# EAGLE design bristol_longshot (EAGLE 7.3.0)
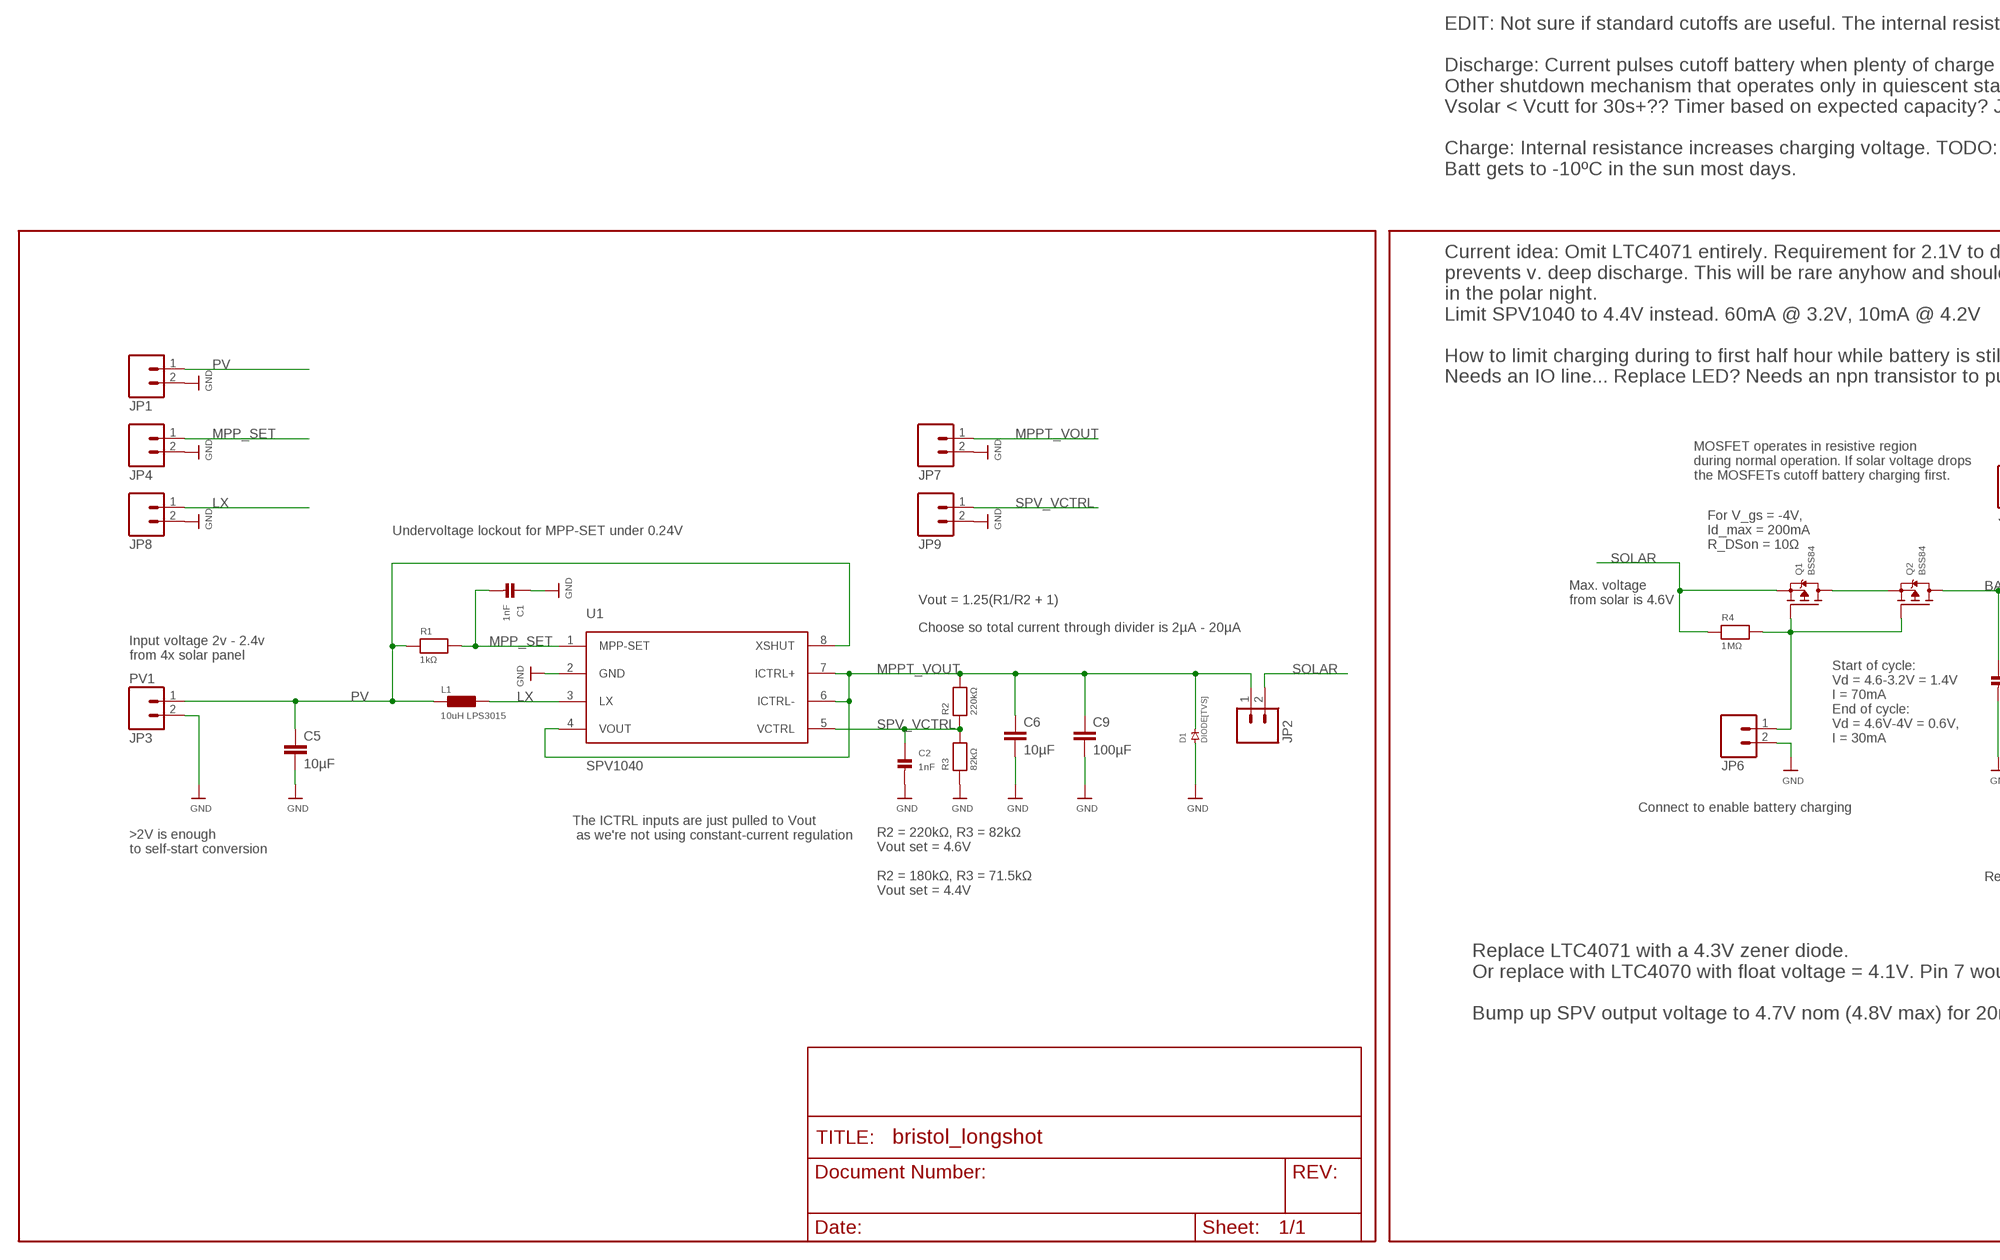
[diagram p0: schematic, sheet 1, part 1 of 2]
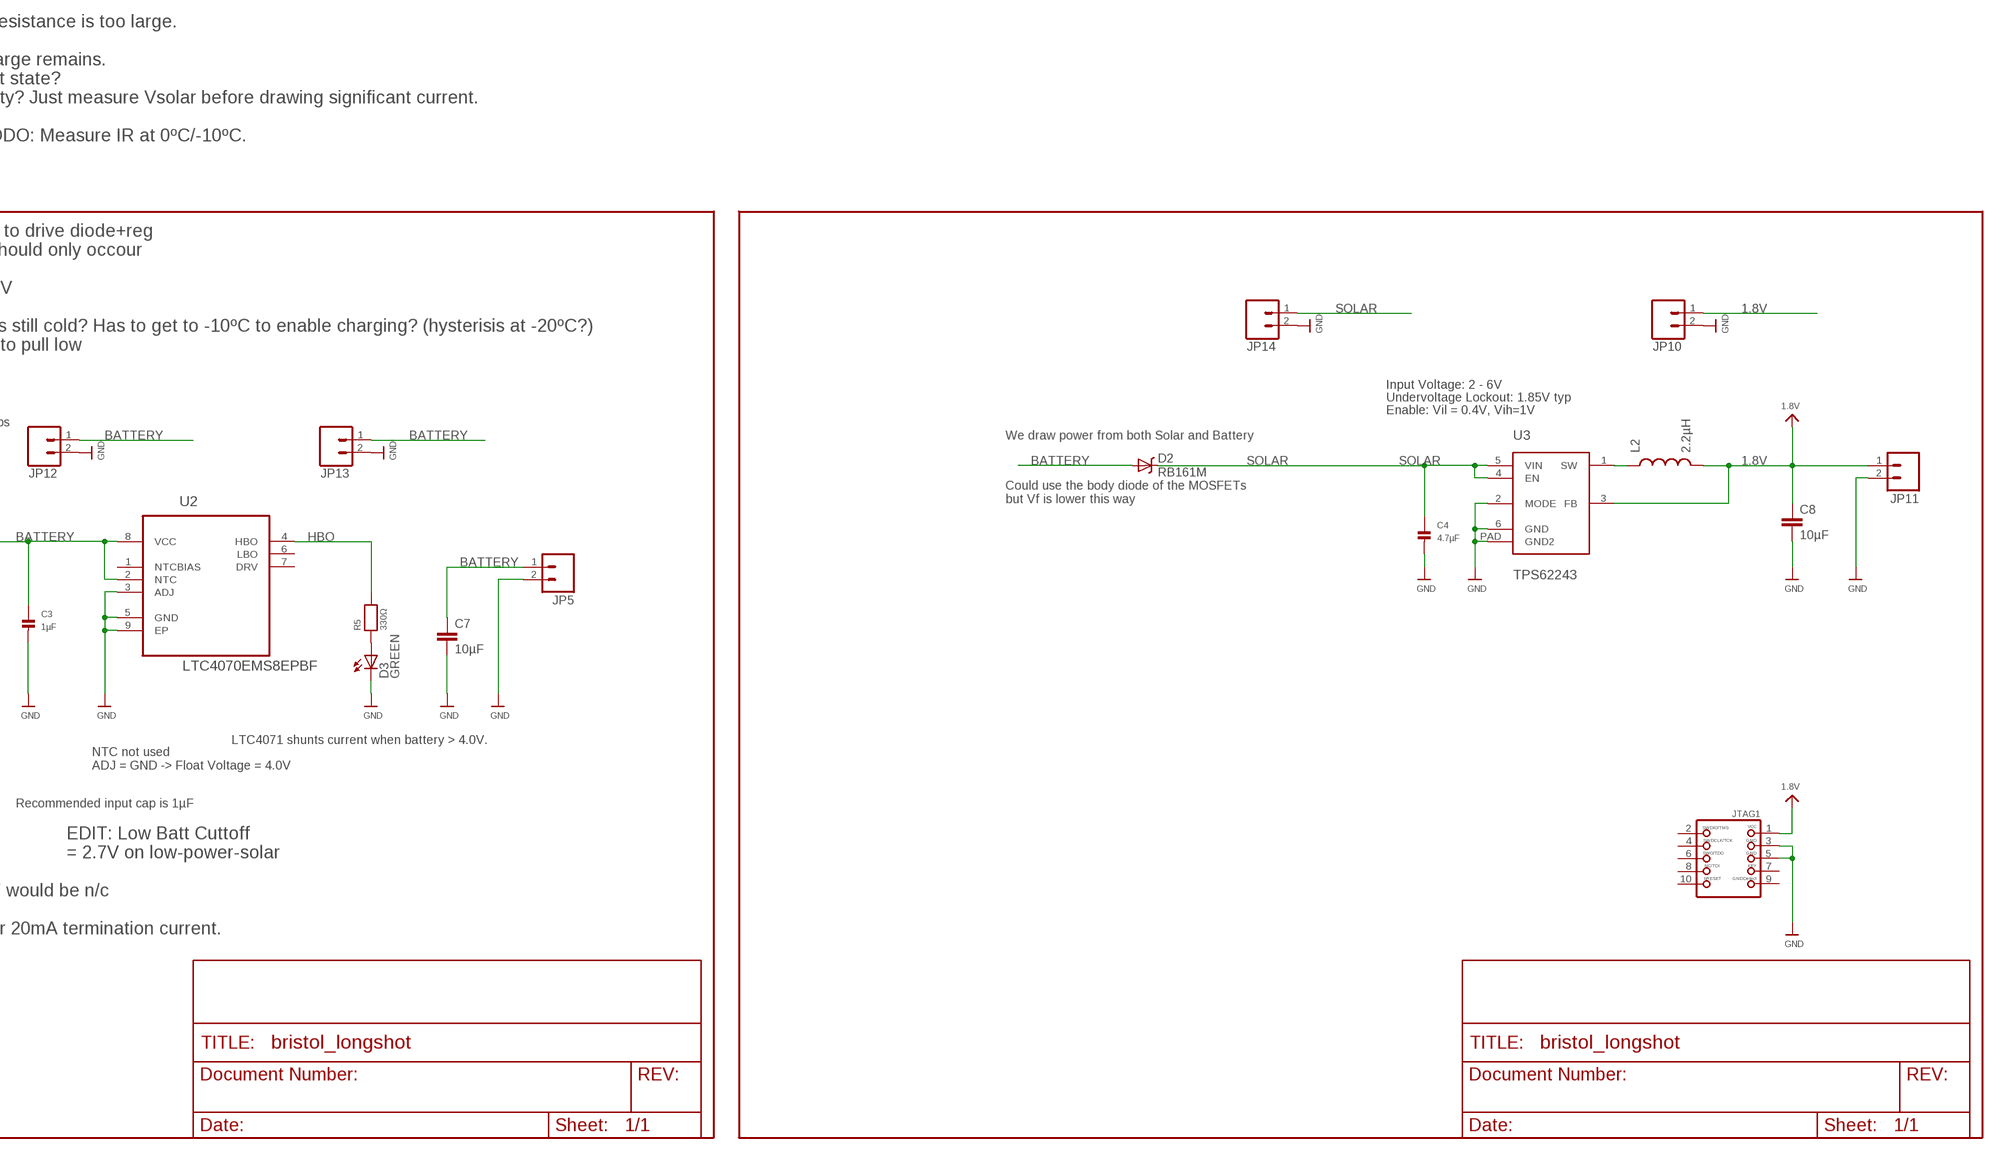
[diagram p1: schematic, sheet 1, part 2 of 2]

## Parts
C1  1nF  CAP_CERAMIC_0402  [_0402@1]
C2  1nF  CAP_CERAMIC_0402  [_0402@1]
C3  1µF  CAP_CERAMIC_0402  [_0402@1]
C4  4.7µF  CAP_CERAMIC_0402  [_0402@1]
C5  10µF  C-EUC0603K  [C0603K]
C6  10µF  C-EUC0603K  [C0603K]
C7  10µF  C-EUC0603K  [C0603K]
C8  10µF  C-EUC0603K  [C0603K]
C9  100µF  C-EUC1206K  [C1206K]
D1  DIODE[TVS]  [SOD123W]
D2  RB161M  [RB161M]
D3  GREEN  LEDCHIPLED_0603  [CHIPLED_0603]
JP1  M02LOCK  [1X02_LOCK]
JP2  M02LOCK  [1X02_LOCK]
JP3  PV1  M023.5MM_LOCK  [SCREWTERMINAL-3.5MM-2_LOCK]
JP4  M02LOCK  [1X02_LOCK]
JP5  M023.5MM_LOCK  [SCREWTERMINAL-3.5MM-2_LOCK]
JP6  M02LOCK  [1X02_LOCK]
JP7  M02LOCK  [1X02_LOCK]
JP8  M02LOCK  [1X02_LOCK]
JP9  M02LOCK  [1X02_LOCK]
JP10  M02LOCK  [1X02_LOCK]
JP11  M023.5MM_LOCK  [SCREWTERMINAL-3.5MM-2_LOCK]
JP12  M02LOCK  [1X02_LOCK]
JP13  M02LOCK  [1X02_LOCK]
JP14  M02LOCK  [1X02_LOCK]
JTAG1  JTAG-CORTEXM3SMT  [2X05_1.27MM_SMT]
L1  10uH LPS3015  IND-LPS3015  [LPS3015]
L2  2.2µH  INDUCTOR1007  [1007]
Q1  BSS84  NX2301P  [SOT23]
Q2  BSS84  NX2301P  [SOT23]
R1  1kΩ  RESISTOR_0402  [_0402]
R2  220kΩ  RESISTOR_0402  [_0402]
R3  82kΩ  RESISTOR_0402  [_0402]
R4  1MΩ  RESISTOR_0402  [_0402]
R5  330Ω  RESISTOR_0402  [_0402]
U1  SPV1040  [TSSOP8]
U2  LTC4070EMS8EPBF  [SOP65P490X110-9N]
U3  TPS62243  [S-PWSON-N6]

## Nets
1.8V: C8.1 JP10.1 JP11.1 JTAG1.1 L2.2 U3.3(FB)
BATT_MOSFET_CTRL: JP6.1 Q1.1(G) Q2.1(G) R4.2
BATTERY: C3.1 C7.1 D2.ANODE(A) JP5.1 JP12.1 JP13.1 Q2.3(D) U2.2(NTC) U2.8(VCC)
BATTERY_MOSFET_1: Q1.3(D) Q2.2(S)
CHG_LED: D3.A R5.1
GND: C1.1 C2.2 C3.2 C4.2 C5.2 C6.2 C7.2 C8.2 C9.2 D1.P$1 D3.C JP1.2 JP3.2 JP4.2 JP5.2 JP6.2 JP7.2 JP8.2 JP9.2 JP10.2 JP11.2 JP12.2 JP13.2 JP14.2 JTAG1.3 JTAG1.5 R3.1 U1.2(GND) U2.3(ADJ) U2.5(GND) U2.9(EP) U3.2(MODE) U3.6(GND) U3.PAD(GND2)
HBO: R5.2 U2.4(HBO)
LX: JP8.1 L1.2_1 L1.2_2 L1.2_3 L1.2_4 L1.2_5 L1.2_6 L1.2_7 L1.2_8 L1.2_9 U1.3(LX)
MPP_SET: C1.2 JP4.1 R1.2 U1.1(MPP-SET)
MPPT_VOUT: C6.1 C9.1 D1.P$2 JP2.1 JP7.1 R2.2 U1.4(VOUT) U1.6(ICTRL-) U1.7(ICTRL+)
N$7: L2.1 U3.1(SW)
PV: C5.1 JP1.1 JP3.1 L1.1_1 L1.1_2 L1.1_3 L1.1_4 L1.1_5 L1.1_6 L1.1_7 L1.1_8 L1.1_9 R1.1 U1.8(XSHUT)
SOLAR: C4.1 D2.CATHODE(C) JP2.2 JP14.1 Q1.2(S) R4.1 U3.4(EN) U3.5(VIN)
SPV_VCTRL: C2.1 JP9.1 R2.1 R3.2 U1.5(VCTRL)
Unconnected: JTAG1.2 JTAG1.4 JTAG1.6 JTAG1.7 JTAG1.8 JTAG1.9 JTAG1.10 U2.6(LBO) U2.7(DRV)

## Notes on the sheet
- EDIT: Not sure if standard cutoffs are useful. The internal resistance is too large.
  
  Discharge: Current pulses cutoff battery when plenty of charge remains.
  Other shutdown mechanism that operates only in quiescent state? 
  Vsolar < Vcutt for 30s+?? Timer based on expected capacity? Just measure Vsolar before drawing significant current.
  
  Charge: Internal resistance increases charging voltage. TODO: Measure IR at 0ºC/-10ºC.
  Batt gets to -10ºC in the sun most days.
- Current idea: Omit LTC4071 entirely. Requirement for 2.1V to drive diode+reg
  prevents v. deep discharge. This will be rare anyhow and should only occour 
  in the polar night.
  Limit SPV1040 to 4.4V instead. 60mA @ 3.2V, 10mA @ 4.2V
  
  How to limit charging during to first half hour while battery is still cold? Has to get to -10ºC to enable charging? (hysterisis at -20ºC?)
  Needs an IO line... Replace LED? Needs an npn transistor to pull low
- Input Voltage: 2 - 6V
- Undervoltage Lockout: 1.85V typ
- Enable: Vil = 0.4V, Vih=1V
- MOSFET operates in resistive region
  during normal operation. If solar voltage drops
  the MOSFETs cutoff battery charging first.
- We draw power from both Solar and Battery
- Undervoltage lockout for MPP-SET under 0.24V
- For V_gs = -4V,
  Id_max = 200mA
  R_DSon = 10Ω
- Could use the body diode of the MOSFETs
  but Vf is lower this way
- Vout = 1.25(R1/R2 + 1)
- Max. voltage
  from solar is 4.6V
- Choose so total current through divider is 2µA - 20µA
- Input voltage 2v - 2.4v
  from 4x solar panel
- Start of cycle:
  Vd = 4.6-3.2V = 1.4V
  I = 70mA
  End of cycle: 
  Vd = 4.6V-4V = 0.6V, 
  I = 30mA
- Connect to enable battery charging | LTC4071 shunts current when battery > 4.0V.
- The ICTRL inputs are just pulled to Vout
   as we're not using constant-current regulation
- NTC not used
  ADJ = GND -> Float Voltage = 4.0V
- >2V is enough
  to self-start conversion
- Recommended input cap is 1µF
- R2 = 220kΩ, R3 = 82kΩ
  Vout set = 4.6V
  
  R2 = 180kΩ, R3 = 71.5kΩ
  Vout set = 4.4V
- EDIT: Low Batt Cuttoff
  = 2.7V on low-power-solar
- Replace LTC4071 with a 4.3V zener diode.
  Or replace with LTC4070 with float voltage = 4.1V. Pin 7 would be n/c
  
  Bump up SPV output voltage to 4.7V nom (4.8V max) for 20mA termination current.

## Power pins joined to a net without a drawn wire
NTCBIAS: U2.1(NTCBIAS)

## Library data of the parts
C1-C4 = microbuilder_v3:CAP_CERAMIC: Ceramic Capacitors 0402 - 0402 Surface Mount Capacitors 16pF 50V 5% [Digikey: 445-4899-2-ND] 18pF 50V 5% [Digikey: 490-1281-2-ND] 22pF 50V 5% [Digikey: 490-1283-2-ND] 68pF 50V 5% [Digikey: 490-1289-2-ND] 0.1uF 10V 10% [Digikey: 490-1318-2-ND] 1.0uF 6.3V 10% [Digikey: 490-1320-2-ND] 0603 - 0603 Surface Mount Capacitors 16 pF 50V 5% [Digikey: 445-5051-2-ND] 22 pF 50V [Digikey: PCC220ACVTR-ND] 33 pF 50V 5% [Digikey: 490-1415-1-ND] 56pF 50V 5% [Digikey: 490-1421-1-ND] 220pF 50V 5% [Digikey: 445-1285-1-ND] 680 pF 50V 2200 pF 50V 5% C0G [Digikey: 445-1297-1-ND] 5600 pF 100V 5% X7R [Digikey: 478-3711-1-ND] 0.1 µF 25V 10% [Digikey: PCC2277TR-ND] 0.22 µF 16V 10% X7R [Digikey: 445-1318-1-ND] 1.0 µF 25V 10% [Digikey: 445-5146-2-ND] 0603 - RF Specific 3pF 250V +/-0.1pF RF [Digikey: 712-1347-1-ND] 18 pF 250V 5% [Digikey: 478-3505-1-ND or 712-1322-1-ND] 56 pF 250V 5% C0G RF [Digikey: 490-4867-1-ND] 68 pF 250V RF [Digikey: 490-4868-1-ND] 0805 - 0805 Surface Mount Capacitors 220 pF 250V 2% RF Ceramic Capacitor [Digikey: 712-1398-1-ND] 1000 pF 50V 2% NP0 Ceramic Capacitor [Digikey: 478-3760-1-ND] 0.1 µF 25V 10% Ceramic Capacitor [Digikey: PCC1828TR-ND] 1.0 µF 16V 10% Ceramic Capacitor[Digikey: 490-1691-2-ND] 10.0 µF 10V 10% Ceramic Capacitor[Digikey: 709-1228-1-ND] 10.0 uF 16V 10% Ceramic Capacitor [Digikey: 478-5165-2-ND] 47 uF 6.3V 20% Ceramic Capacitor [Digikey: 587-1779-1-ND or 399-5506-1-ND] 1206 - 1206 Surface Mount Capacitors 47uF 10V 20% Ceramic Capacitor [Digikey: 490-5528-1-ND or 399-5508-1-ND or 445-6010-1-ND] 100uF 6.3V -20%, +80% Y5V Ceramic Capacitor (Digikey: 490-4512-1-ND, Mouser: 81-GRM31CF50J107ZE1L)
C5-C9 = resistor:C-EU: CAPACITOR, European symbol
D1 = nxp:DIODE[TVS]
D2 = RB161M:RB161M
D3 = led:LED: LED OSRAM: - CHIPLED LG R971, LG N971, LY N971, LG Q971, LY Q971, LO R971, LY R971 LH N974, LH R974 LS Q976, LO Q976, LY Q976 LO Q996 - Hyper CHIPLED LW Q18S LB Q993, LB Q99A, LB R99A - SideLED LS A670, LO A670, LY A670, LG A670, LP A670 LB A673, LV A673, LT A673, LW A673 LH A674 LY A675 LS A676, LA A676, LO A676, LY A676, LW A676 LS A679, LY A679, LG A679 - Hyper Micro SIDELED® LS Y876, LA Y876, LO Y876, LY Y876 LT Y87S - SmartLED LW L88C, LW L88S LB L89C, LB L89S, LG L890 LS L89K, LO L89K, LY L89K LS L896, LA L896, LO L896, LY L896 - TOPLED LS T670, LO T670, LY T670, LG T670, LP T670 LSG T670, LSP T670, LSY T670, LOP T670, LYG T670 LG T671, LOG T671, LSG T671 LB T673, LV T673, LT T673, LW T673 LH T674 LS T676, LA T676, LO T676, LY T676, LB T676, LH T676, LSB T676, LW T676 LB T67C, LV T67C, LT T67C, LS T67K, LO T67K, LY T67K, LW E67C LS E67B, LA E67B, LO E67B, LY E67B, LB E67C, LV E67C, LT E67C LW T67C LS T679, LY T679, LG T679 LS T770, LO T770, LY T770, LG T770, LP T770 LB T773, LV T773, LT T773, LW T773 LH T774 LS E675, LA E675, LY E675, LS T675 LS T776, LA T776, LO T776, LY T776, LB T776 LHGB T686 LT T68C, LB T68C - Hyper Mini TOPLED® LB M676 - Mini TOPLED Santana® LG M470 LS M47K, LO M47K, LY M47K Source: http://www.osram.convergy.de LUXEON: - LUMILED® LXK2-PW12-R00, LXK2-PW12-S00, LXK2-PW14-U00, LXK2-PW14-V00 LXK2-PM12-R00, LXK2-PM12-S00, LXK2-PM14-U00 LXK2-PE12-Q00, LXK2-PE12-R00, LXK2-PE12-S00, LXK2-PE14-T00, LXK2-PE14-U00 LXK2-PB12-K00, LXK2-PB12-L00, LXK2-PB12-M00, LXK2-PB14-N00, LXK2-PB14-P00, LXK2-PB14-Q00 LXK2-PR12-L00, LXK2-PR12-M00, LXK2-PR14-Q00, LXK2-PR14-R00 LXK2-PD12-Q00, LXK2-PD12-R00, LXK2-PD12-S00 LXK2-PH12-R00, LXK2-PH12-S00 LXK2-PL12-P00, LXK2-PL12-Q00, LXK2-PL12-R00 Source: www.luxeon.com KINGBRIGHT: KA-3528ASYC Source: www.kingbright.com
JP1-JP14 = SparkFun:M02: Header 2 Standard 2-pin 0.1" header. Use with straight break away headers (SKU : PRT-00116), right angle break away headers (PRT-00553), swiss pins (PRT-00743), machine pins (PRT-00117), and female headers (PRT-00115). Molex polarized connector foot print use with SKU : PRT-08233 with associated crimp pins and housings.
JTAG1 = microbuilder_v3:JTAG-CORTEXM3: Serial Wire (SW-DP) Connector This standard 0.05" 10-pin connector is for use with the Cortex M0/M3's native SWD (serial wire debugger) interface (SW-DP). Some boards support a 20-pin combined JTAG+SWD connector (SWJ-DP), such as the LPC1700 family, but many smaller devices only work with SWD which typically use the smaller 10-pin SW-DP connecter (the LPC1300 family, for example, only supports SWD). 2x05 1.27mm/0.05" Connector: This is the standard SMT connector defined by ARM for all Cortex devices, and should be used in most situations and for forward-compatibility since any new devices coming to market will likely use this connector. MOLEX 10 Pin 0.1" Connector: This 0.1" 10 pin connector has the same pin layout as the standard 0.05" connector, but is easier to work with if you are using standard jumper wires or custom cables to connect your SWD hardware. MOLEX 20 Pin 0.1" Connector: This 0.1" 20 pin connector is the same model used for ARM7/ARM9 JTAG debuggers, but is connected to match the pins on the Segger J-Link for ARM (which supports both JTAG and SWD debugging). See the following document from ARM for more information on Cortex M3 Debug Connectors: http://infocenter.arm.com/help/topic/com.arm.doc.faqs/attached/13634/cortex_debug_connectors.pdf And the following page for an overview with images of the different connector types: http://www.keil.com/peripherals/coresight/connectors.asp
L1 = PecanFemto4:IND-LPS3015
L2 = SparkFun:INDUCTOR: Inductors Basic Inductor/Choke - 0603 and 1206. Footprints are not proven and vary greatly between part numbers.
Q1 Q2 = nxp:NX2301P
R1-R5 = microbuilder_v3:RESISTOR: Resistors 0402 - 0402 Surface Mount Package 22 Ohm 1% 1/16W [Digikey: 311-22.0LRTR-ND] 33 Ohm 5% 1/16W 1.0K 5% 1/16W 1.5K 5% 1/16W 2.0K 1% 1/16W 10.0K 1% 1/16W [Digikey: 311-10.0KLRTR-ND] 10.0K 5% 1/16W [Digikey: RMCF0402JT10K0TR-ND] 12.1K 1% 1/16W [Digikey: 311-22.0LRTR-ND] 100.0K 5% 1/16W 0603 - 0603 Surface Mount Package 0 Ohm 1/10 Watt 1% Resistor 15 Ohm 1/10 Watt 1% Resistor 33 Ohm 1/10 Watt 1% Resistor 49.9 Ohm 1/10 Watt 1% Resistor 100 Ohm 1/10 Watt 1% Resistor 150 Ohm 1/10 Watt 1% Resistor 240 Ohm 1/10 Watt 1% Resistor 390 Ohm 1/10 Watt 1% Resistor 560 Ohm 1/10 Watt 1% Resistor 680 Ohm 1/10 Watt 1% Resistor 750 Ohm 1/10 Watt 1% Resistor 1.0K Ohm 1/10 Watt 1% Resistor 1.5K Ohm 1/10 Watt 1% Resistor 2.0K Ohm 1/10 Watt 1% Resistor 2.2K Ohm 1/10 Watt 1% Resistor 3.3K Ohm 1/10 Watt 1% Resistor 4.7K Ohm 1/10 Watt 1% Resistor 10.0K Ohm 1/10 Watt 1% Resistor 12.0K Ohm 1/10 Watt 1% Resistor 12.1K Ohm 1/10 Watt 1% Resistor 20.0K Ohm 1/10 Watt 1% Resistor 33.0K Ohm 1/10 Watt 1% Resistor 100.0K Ohm 1/10 Watt 1% Resistor 0805 - 0805 Surface Mount Package 0 Ohm 1/8 Watt 1% Resistor 33 Ohm 1/8 Watt 1% Resistor 100 Ohm 1/8 Watt 1% Resistor 150 Ohm 1/8 Watt 1% Resistor 200 Ohm 1/8 Watt 1% Resistor 240 Ohm 1/8 Watt 1% Resistor 330 Ohm 1/8 Watt 1% Resistor 390 Ohm 1/8 Watt 1% Resistor 470 Ohm 1/8 Watt 1% Resistor 1.0K Ohm 1/8 Watt 1% Resistor 1.5K Ohm 1/8 Watt 1% Resistor 2.0K Ohm 1/8 Watt 1% Resistor 4.7K Ohm 1/8 Watt 1% Resistor 5.1K Ohm 1/8 Watt 1% Resistor 5.6K Ohm 1/8 Watt 1% Resistor 10.0K Ohm 1/8 Watt 1% Resistor 22.0K Ohm 1/8 Watt 1% Resistor 33.0K Ohm 1/8 Watt 1% Resistor 100K Ohm 1/8 Watt 1% Resistor 1206 - 1206 Surface Mount Package 2012 - 2010 Surface Mount Package 0.11 Ohm 1/2 Watt 1% Resistor - Digikey: RHM.11UCT-ND
U1 = spv1040:SPV1040
U2 = LTC4070_EMS8:LTC4070EMS8EPBF: Li-Ion/Polymer Shunt Battery Charger System; MPN: LTC4070EMS8E#PBF; OC_FARNELL: 1839141; OC_NEWARK: 67R4287; PACKAGE: MSOP-8; SUPPLIER: Linear Technology
U3 = TPS62243:TPS62243

## Board
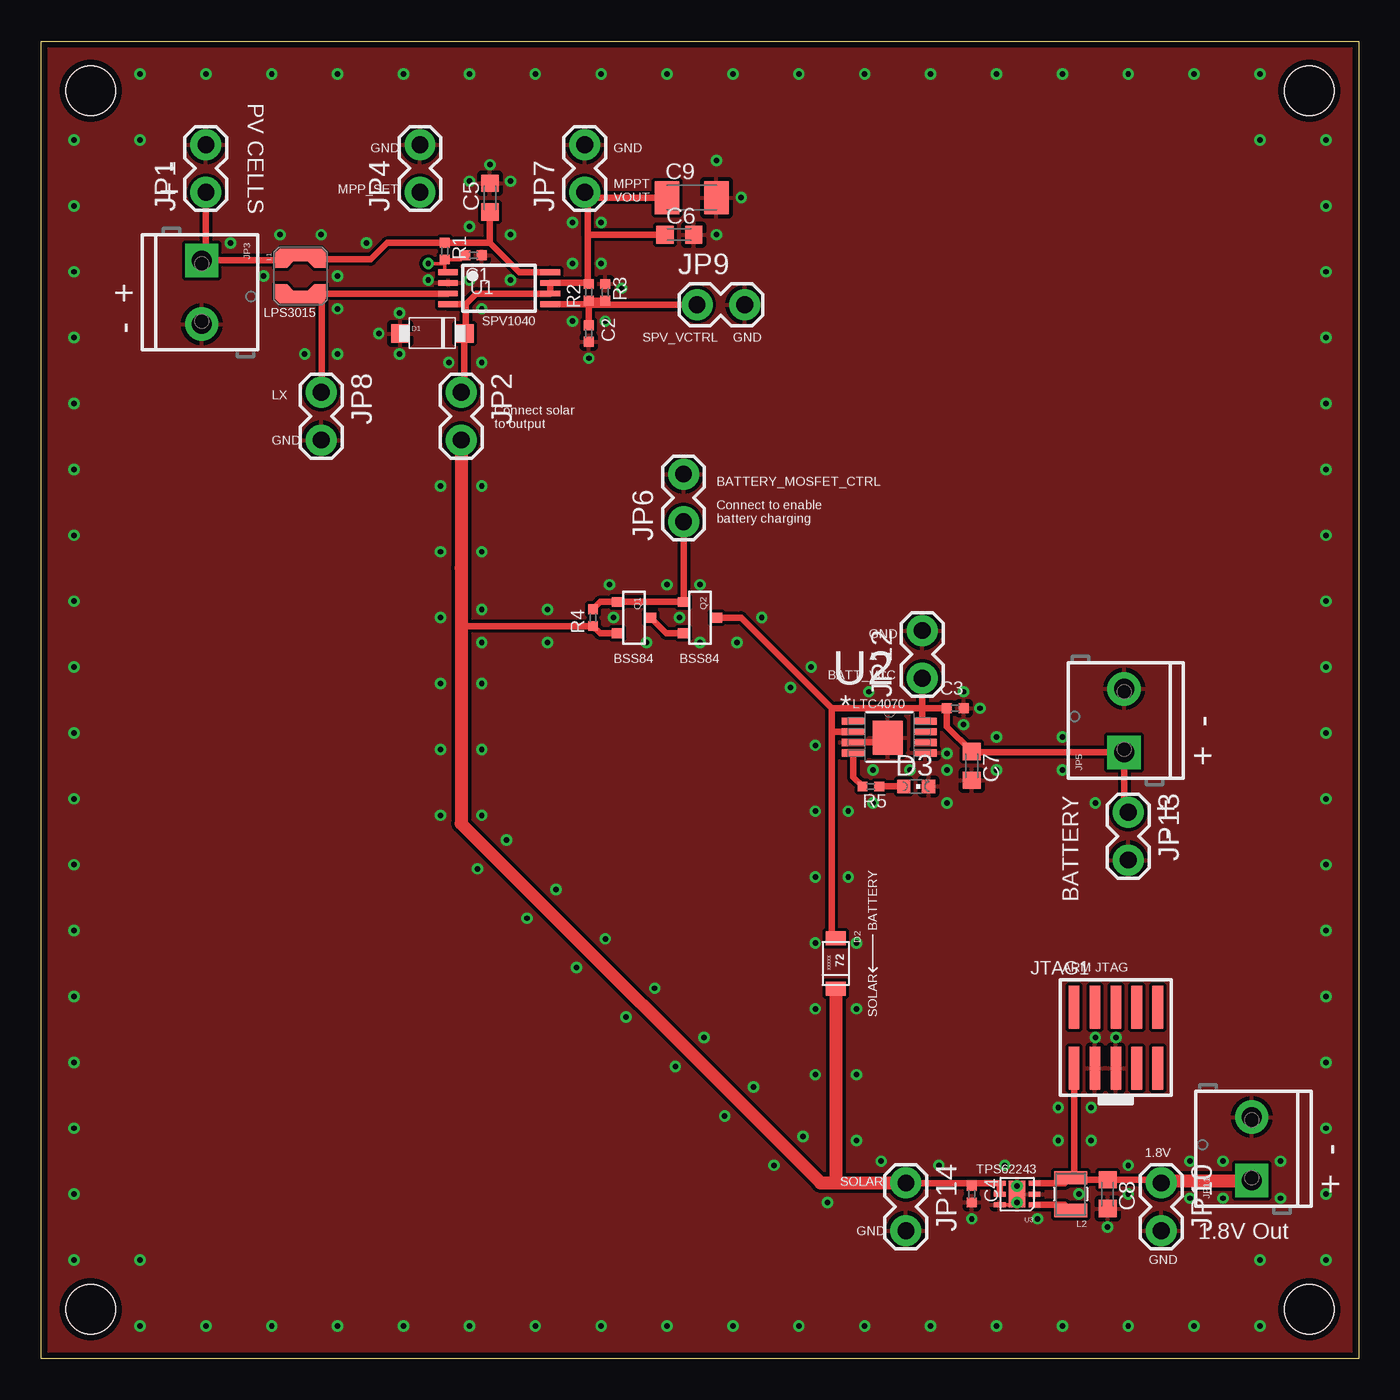
[diagram p2: board, top side]
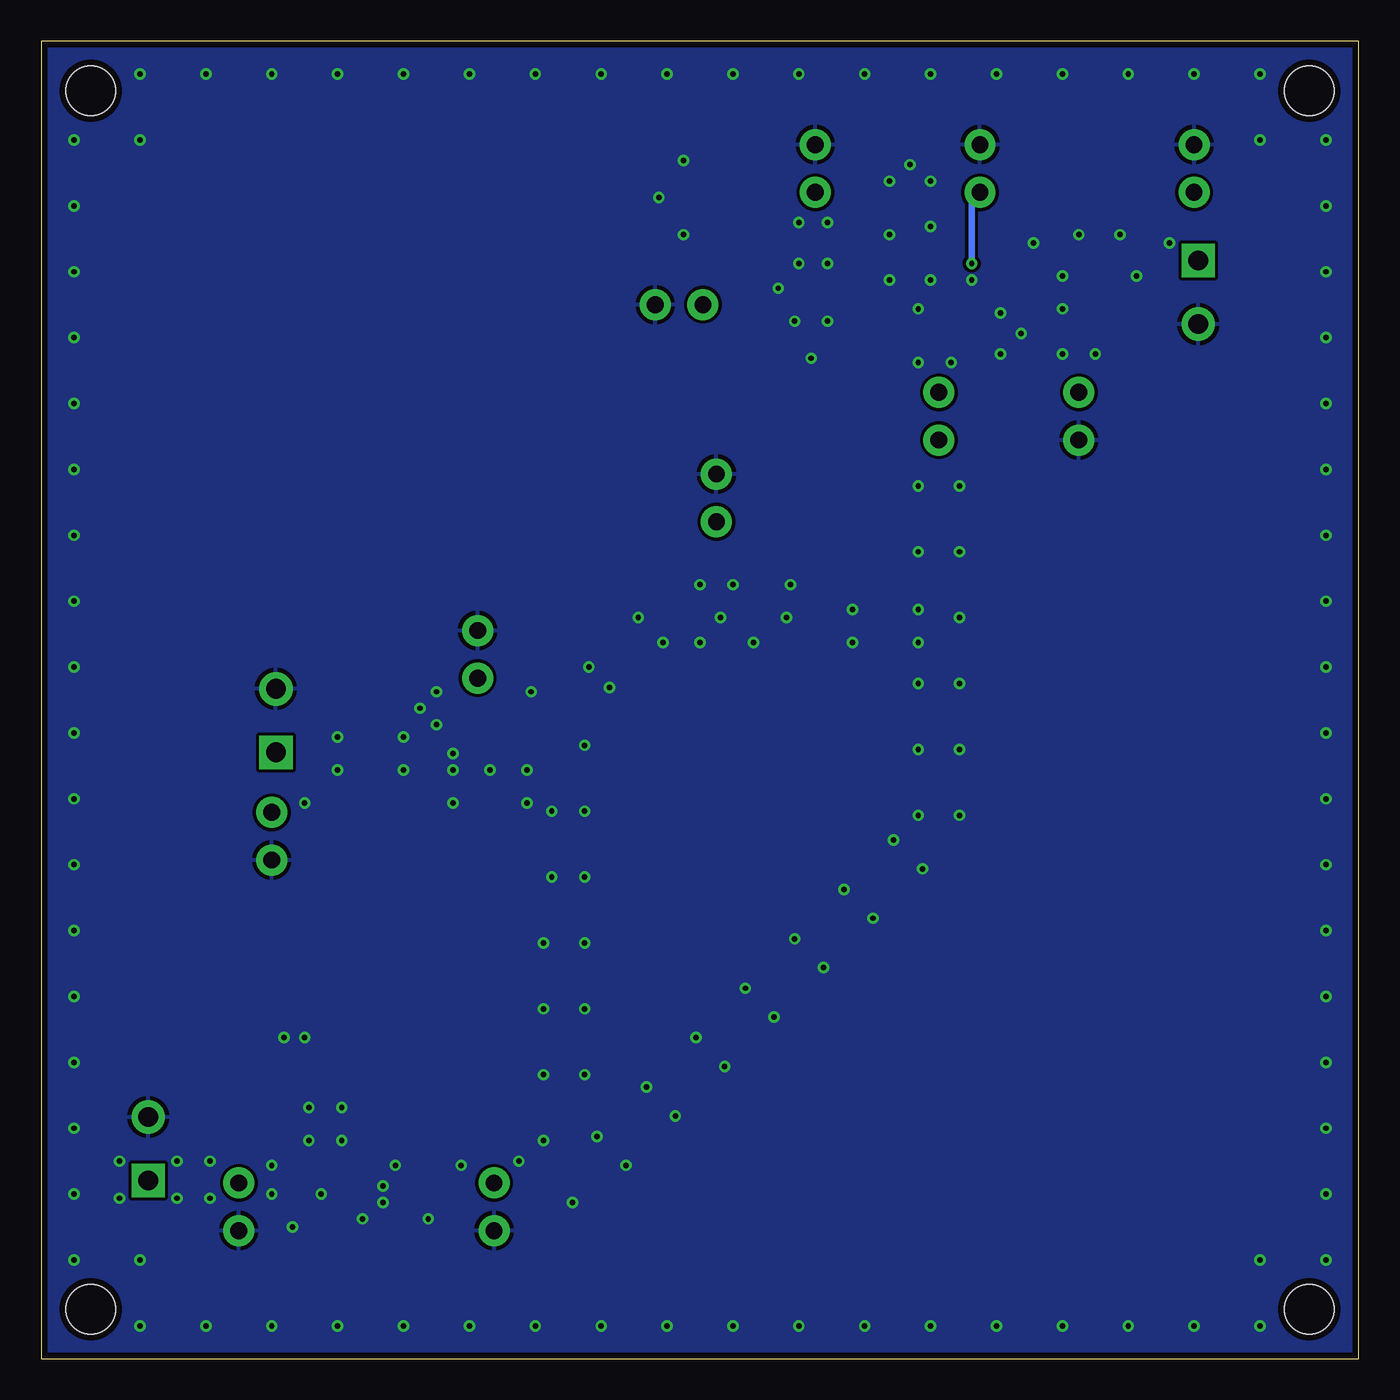
[diagram p3: board, bottom side, seen from below]

Size 80 x 80 mm. Coordinates in mm from the lower left corner, seen from the top.
Outline: 0,80 80,80 80,0 0,0 0,80
Copper layers (1*16): Top 0.0356mm / dielectric 1.5011mm / Bottom 0.0356mm
Design rules "oshpark": minimum track width 6mil, minimum drill 13mil, track to track 6mil, track to pad 6mil, pad to pad 6mil, via to via 6mil, smd to smd 6mil, copper to edge 15mil, drill to drill 6mil, minimum pad ring 7mil, minimum via ring 7mil, stop-mask expansion 3mil, vias tented up to drill 0mil, thermal gap 10mil
Holes 3 mm at 77,3 3,3 3,77 77,77

### Footprints (pad centres in the part's own frame; a part is rotated, then mirrored left to right if it is on the bottom)
_0402@1 = smd 0.6 x 0.6: 1 -0.508,0; 2 0.508,0
C0603K = smd 1.05 x 1.08: 1 -0.875,0; 2 0.875,0
C1206K = smd 1.5 x 2: 1 -1.5,0; 2 1.5,0
SOD123W = smd 1.1 x 1.1: P$1 -1.95,0; P$2 1.95,0
RB161M = smd 1.2 x 0.85: ANODE 0,-1.525; CATHODE 0,1.525
CHIPLED_0603 = smd 0.8 x 0.8: A 0,-0.75; C 0,0.75
1X02_LOCK = drill 1.016 pad 1.88: 1 -0.178,0; 2 2.718,0
SCREWTERMINAL-3.5MM-2_LOCK = drill 1.2 pad 2.032 square: 1 -0.178,0 | drill 1.2 pad 2.032: 2 3.678,0
2X05_1.27MM_SMT = smd 0.65 x 2.6: 1 -2.54,-1.85; 2 -2.54,1.85; 3 -1.27,-1.85; 4 -1.27,1.85; 5 0,-1.85; 6 0,1.85; 7 1.27,-1.85; 8 1.27,1.85; 9 2.54,-1.85; 10 2.54,1.85
LPS3015 = smd 0.762 x 2.54: 1_1 -1.27,0; 2_1 1.27,0 | smd 0.889 x 0.254: 1_2 -0.953,-1.397; 1_3 -0.953,1.397; 2_2 0.953,-1.397; 2_3 0.953,1.397 | smd 0.381 x 0.445: 1_4 -0.699,-1.048; 1_5 -0.699,1.048; 2_4 0.699,-1.048; 2_5 0.699,1.048 | smd 0.359 x 0.359 rotated 45: 1_6 -1.398,-1.271; 1_7 -1.398,1.271 | smd 0.538 x 0.538 rotated 45: 1_8 -0.889,-0.823; 1_9 -0.889,0.823 | smd 0.359 x 0.359 rotated 225: 2_6 1.398,-1.271; 2_7 1.398,1.271 | smd 0.538 x 0.538 rotated 225: 2_8 0.889,-0.823; 2_9 0.889,0.823
1007 = smd 2 x 0.8: 1 0,1; 2 0,-1
SOT23 = smd 0.6 x 0.7: 1 -0.95,-1; 2 0.95,-1; 3 0,1
_0402 = smd 0.6 x 0.6: 1 -0.508,0; 2 0.508,0
TSSOP8 = smd 1.2 x 0.35: 1 -0.8,0.475; 2 -0.8,-0.175; 3 -0.8,-0.825; 4 -0.8,-1.475; 5 5.4,-1.475; 6 5.4,-0.825; 7 5.4,-0.175; 8 5.4,0.475
SOP65P490X110-9N = smd 1.397 x 0.432: 1 -2.184,0.965; 2 -2.184,0.33; 3 -2.184,-0.33; 4 -2.184,-0.965; 5 2.184,-0.965; 6 2.184,-0.33; 7 2.184,0.33; 8 2.184,0.965 | smd 1.829 x 2.057: 9 -0.102,-0.051
S-PWSON-N6 = smd 0.3 x 0.7: 1 -0.65,-1.05; 2 0,-1.05; 3 0.65,-1.05; 4 0.65,1.05; 5 0,1.05; 6 -0.65,1.05 | smd 1.6 x 1: PAD 0,0

### Placement (x,y rotation side)
C1  26.25,67 180 top
C2  33.25,62.25 270 top
C3  55.5,39.5 0 top
C4  56.5,10 270 top
C5  27.25,70.5 90 top
C6  38.75,68.25 0 top
C7  56.5,36 270 top
C8  64.75,10 270 top
C9  39.5,70.5 0 top
D1  23.75,62.25 0 top
D2  48.25,24 180 top
D3  53.12,34.75 270 top
JP1  10,71 90 top
JP2  25.5,58.5 270 top
JP3  9.75,66.5 270 top
JP4  23,71 90 top
JP5  65.75,37 90 top
JP6  39,51 90 top
JP7  33,71 90 top
JP8  17,58.5 270 top
JP9  40,64 0 top
JP10  68,10.5 270 top
JP11  73.5,11 90 top
JP12  53.5,41.5 90 top
JP13  66,33 270 top
JP14  52.5,10.5 270 top
JTAG1  65.25,19.5 0 top
L1  15.75,65.75 270 top
L2  62.5,10 180 top
Q1  36,45 270 top
Q2  40,45 270 top
R1  24.5,67.25 270 top
R2  33.25,64.75 90 top
R3  34.25,64.75 270 top
R4  33.5,45 90 top
R5  50.38,34.75 180 top
U1  25.5,65.5 0 top
U2  51.5,37.75 0 top
U3  59.25,10 90 top

### Tracks (layer width: path | path; a pad name or v marks a point on that pad's centre or on a via)
1.8V
  Top 0.4: 62.71,17.75 JTAG1.1 62.71,11.21 L2.2 | U3.3 62.15,10.65 L2.2 | JP10.1 67.8,10.88 C8.1 62.62,10.88 L2.2
  Top 0.8: JP10.1 68,10.82 JP11.1
BATT_MOSFET_CTRL
  Top 0.4: R4.2 33.94,45.95 Q1.1 Q2.1 JP6.1
BATTERY
  Top 0.4: JP13.1 65.75,33.43 JP5.1 56.55,36.82 C7.1 54.99,38.38 C3.1 53.5,39.5 | Q2.3 42.5,45 48,39.5 | JP12.1 53.5,39.5 | D2.ANODE 48,25.52 48,38 | 48,38 48,39.5 | 53.5,39.5 48,39.5 | U2.2 48.08,38.08 48,38 | 53.5,39.5 53.5,38.9 U2.8
BATTERY_MOSFET_1
  Top 0.4: Q1.3 37.95,44.05 Q2.2
CHG_LED
  Top 0.4: R5.1 D3.A
GND  (via drill 0.33)
  Top 0.2: U3.6 59.25,9.35 v59.25,9.5
  Top 0.4: U2.3 51.12,37.42 U2.9
  other vias: 59.25,10.5 26,65.5 33.25,60.75 56.5,8.5 64,19.5 65.25,19.5 6,78 10,78 6,74 2,74 2,70 2,66 2,62 2,58 2,54 2,50 2,46 2,42 2,38 2,34 2,30 2,26 2,22 2,18 2,14 2,10 2,6 6,6 6,2 10,2 14,2 18,2 22,2 26,2 30,2 34,2 38,2 42,2 46,2 50,2 54,2 58,2 62,2 66,2 70,2 22,78 26,78 30,78 34,78 38,78 42,78 46,78 50,78 54,78 58,78 62,78 66,78 70,78 74,78 74,74 78,74 78,70 78,66 78,62 78,58 78,54 78,50 78,46 78,42 78,38 78,34 78,30 78,26 78,22 78,18 78,14 78,10 78,6 74,6 74,2 14,78 18,78 28.5,65.5 27.25,72.5 26,71.5 28.5,71.5 28.5,68.25 32.25,66.5 32.25,69 34,69 34,66.5 35.25,65 41,68.25 42.5,70.5 41,72.75 11.5,67.75 14.5,68.25 17,68.25 19.75,67.75 26,68.75 23.5,65.5 21.75,63.5 20.5,62.25 21.75,61 18,63.75 13.5,65.75 18,65.75 34.25,63 32.25,63 26.75,63.75 24.75,60.5 26.75,60.5 16,61 18,61 24.25,53 24.25,49 24.25,45 24.25,41 24.25,37 24.25,33 26.5,29.75 29.5,26.75 32.5,23.75 35.5,20.75 38.5,17.75 41.5,14.75 44.5,11.75 47.75,9.5 26.75,53 26.75,49 26.75,41 26.75,37 26.75,33 28.25,31.5 31.25,28.5 34.25,25.5 37.25,22.5 40.25,19.5 43.25,16.5 46.25,13.5 56,40.5 56,38.5 57,39.5 50.5,35.75 52.75,35.75 55,36.75 55,35.75 55,33.75 50.5,33.75 58,35.75 62,35.75 64,33.75 58,37.75 62,37.75 26.75,43.5 30.75,43.5 34.75,45 38.75,45 36.75,43.5 40,43.5 26.75,45.5 30.75,45.5 40,47 34.5,47 38,47 42.25,43.5 43.75,45 46.75,42 50.25,40.5 45.5,40.75 47,37.25 47,33.25 47,29.25 49,33.25 49,29.25 47,25.25 47,21.25 47,17.25 49.5,21.25 49.5,17.25 49.5,13.25 49.5,25.25 60.5,8.5 63,10 66,10 64.75,8 51,12 54.5,11.75 58.5,11.75 61.75,13.25 61.75,15.25 63.75,15.25 63.75,13.25 66,11.75 69.75,12 69.75,9.75 71.75,12 71.75,9.75 75.25,12 75.25,9.75
  pour Top (isolate 0.2): 0,80 80,80 80,0 0,0
  pour Bottom (isolate 0.2): 0,80 80,80 80,0 0,0
HBO
  Top 0.4: R5.2 49.32,35.3 U2.4
LX
  Top 0.2: L1.2_2 14.45,64.8 | 14.45,64.8 L1.2_4 14.89,64.86 L1.2_8 15.31,64.48 L1.2_1 16.19,64.48 L1.2_9 16.61,64.86 L1.2_5 16.89,65.05 L1.2_3 17,64.65 17,64.25 17.02,64.27 L1.2_7 | 14.45,64.8 14.45,64.38 L1.2_6
  Top 0.4: U1.3 16.76,64.67 L1.2_9 | 17.02,64.27 17.02,58.7 JP8.1
MPP_SET  (via drill 0.33)
  Top 0.2: R1.2 24.5,65.97 U1.1 | R1.2 25.48,66.74 C1.2 | v23.5,66.5 24.5,66.5 R1.2
  Bottom 0.4: v23.5,66.5 23.5,70.32 JP4.1
MPPT_VOUT
  Top 0.4: 33.18,65.33 U1.7 U1.6 26.43,64.67 25.77,64.03 | 33.18,65.33 R2.2 | U1.4 25.77,64.03 | 25.77,64.03 25.77,62.33 D1.P$2 25.7,58.88 JP2.1 | 33.18,68.25 33.18,70.5 | 33.18,70.5 33.18,70.64 JP7.1 | C6.1 33.18,68.25 | 33.18,68.25 33.18,65.33 | C9.1 33.18,70.5
N$7
  Top 0.4: U3.1 62.15,9.35 L2.1
PV
  Top 0.2: L1.1_4 15.27,67.02 L1.1_1 16.19,67.02 L1.1_9 16.61,66.64 L1.1_5 16.89,66.45 L1.1_3 17.15,67.02 L1.1_7 | L1.1_6 14.35,67.02 L1.1_2 14.45,66.7 L1.1_4 | L1.1_4 14.74,66.45 L1.1_8
  Top 0.4: 27.24,67.76 R1.1 21.01,67.76 20,66.75 16.68,66.75 L1.1_9 | 27.24,67.76 29.02,65.97 U1.8 | L1.1_2 9.78,66.7 JP3.1 10,66.93 JP1.1 | C5.1 27.24,67.76
SOLAR
  Top 0.4: Q1.2 33.94,44.05 R4.1 25.5,44.49 25.5,48 | U3.4 52.53,10.65 JP14.1 | U3.5 U3.4 | U3.4 56.5,10.65 C4.1
  Top 0.8: JP2.2 25.5,48 25.5,32.5 47.32,10.68 48.25,10.68 | JP14.1 48.5,10.68 48.25,10.68 | D2.CATHODE 48.25,10.68
SPV_VCTRL
  Top 0.4: C2.1 R2.1 | U1.5 33.03,64.03 R2.1 | R2.1 R3.2 33.25,64 JP9.1

### Text on the board
tPlace: PV CELLS | GND | GND | MPP_SET | + - | MPPT / VOUT | LPS3015 | SPV1040 | - + | SPV_VCTRL | GND | LX | GND | Connect solar / to output | BATTERY_MOSFET_CTRL | Connect to enable / battery charging | GND | BSS84 | BSS84 | BATT_VCC | LTC4070 | + - | - + | BATTERY | BATTERY | ARM JTAG | SOLAR | 1.8V | TPS62243 | SOLAR | + - | GND | 1.8V Out | GND